# EAGLE design BusPiratev3.5-SOIC (EAGLE 5.07)
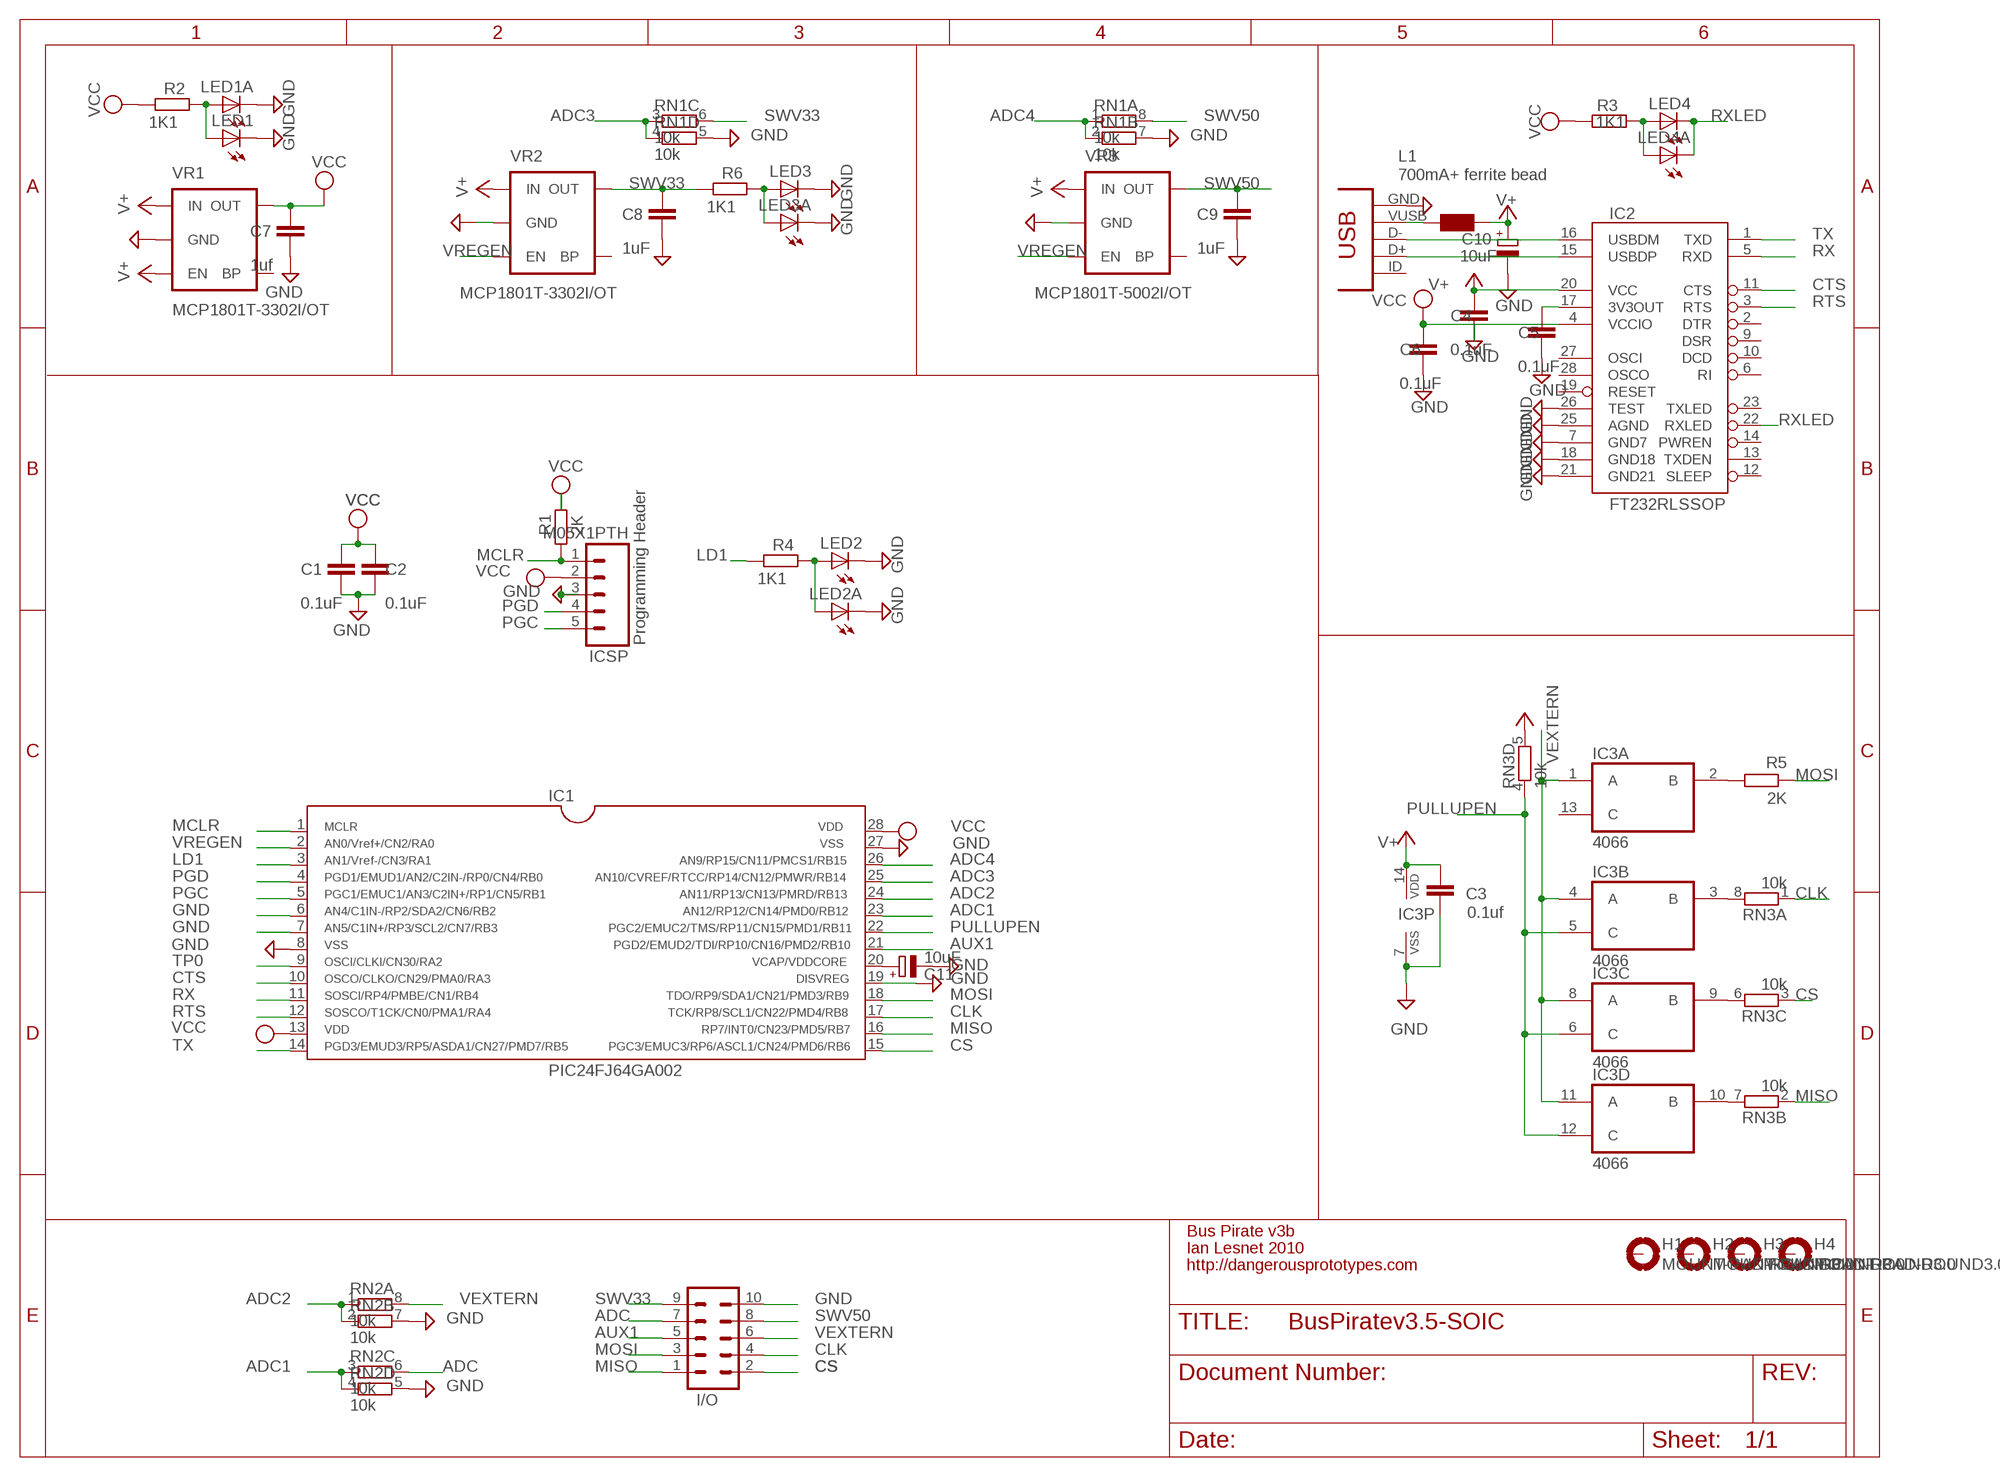
[diagram p0: schematic, sheet 1]

## Parts
C1  0.1uF  CAPC603  [C603]
C2  0.1uF  CAPC603  [C603]
C3  0.1uf  CAPC603  [C603]
C4  0.1uF  CAPC603  [C603]
C5  0.1uF  CAPC603  [C603]
C6  0.1uF  CAPC603  [C603]
C7  1uf  CAPC603  [C603]
C8  1uF  CAPC603  [C603]
C9  1uF  CAPC603  [C603]
C10  10uF  CPOL-EUSMCA  [SMC_A]
C11  10uF  CPOL-EUSMCA  [SMC_A]
H1  MOUNT-PAD-ROUND3.0  [3,0-PAD]
H2  MOUNT-PAD-ROUND3.0  [3,0-PAD]
H3  MOUNT-PAD-ROUND3.0  [3,0-PAD]
H4  MOUNT-PAD-ROUND3.0  [3,0-PAD]
I/O  SPARKFUN_M05X2SHD  [SPARKFUN_2X5-SHROUDED]
IC1  PIC24FJ64GA002  [SO28W]
IC2  FT232RLSSOP  [SSOP28DB]
IC3  4066  [TSSOP14]
ICSP  M05X1PTH  M05  [1X05]
J1  CONN_USB  [CONN_USB_MINI-B]
L1  700mA+ ferrite bead  WE-KIL_0805  [WE-KI_0805_B]
LED1  LEDCHIP-LED0805  [CHIP-LED0805]
LED1A  LEDCHIP-LED0805  [CHIP-LED0805]
LED2  LEDCHIP-LED0805  [CHIP-LED0805]
LED2A  LEDCHIP-LED0805  [CHIP-LED0805]
LED3  LEDCHIP-LED0805  [CHIP-LED0805]
LED3A  LEDCHIP-LED0805  [CHIP-LED0805]
LED4  LEDCHIP-LED0805  [CHIP-LED0805]
LED4A  LEDCHIP-LED0805  [CHIP-LED0805]
R1  2K  RESISTORR603  [R603]
R2  1K1  RESISTORR603  [R603]
R3  1K1  RESISTORR603  [R603]
R4  1K1  RESISTORR603  [R603]
R5  2K  RESISTORR603  [R603]
R6  1K1  RESISTORR603  [R603]
RN1  10k  RNETWORK  [RN8P-4R-CRA06S]
RN2  10k  RNETWORK  [RN8P-4R-CRA06S]
RN3  10k  RNETWORK  [RN8P-4R-CRA06S]
VR1  MCP1801T-3302I/OT  V_REG_LDOSMD  [SOT23-5]
VR2  MCP1801T-3302I/OT  V_REG_LDOSMD  [SOT23-5]
VR3  MCP1801T-5002I/OT  V_REG_LDOSMD  [SOT23-5]

## Nets
$N26: J1.VUSB L1.2
ADC: I/O.7 RN2.6
ADC1: IC1.23 RN2.3 RN2.4
ADC2: IC1.24 RN2.1 RN2.2
ADC3: IC1.25 RN1.3 RN1.4
ADC4: IC1.26 RN1.1 RN1.2
AUX1: I/O.5 IC1.21
CLK: I/O.4 IC1.17 RN3.1
CS: I/O.2 IC1.15 RN3.3
CTS: IC1.10 IC2.11(CTS)
GND: C1.2 C2.2 C3.2 C4.2 C5.2 C6.2 C7.2 C8.2 C9.2 C10.- C11.- I/O.10 IC1.6 IC1.7 IC1.8 IC1.19 IC1.27 IC2.7(GND7) IC2.18(GND18) IC2.21(GND21) IC2.25(AGND) IC2.26(TEST) IC3.7(P:VSS) ICSP.3 J1.GND LED1.C LED1A.C LED2.C LED2A.C LED3.C LED3A.C RN1.5 RN1.7 RN2.5 RN2.7 VR1.2(GND) VR2.2(GND) VR3.2(GND)
LD1: IC1.3 R4.2
MCLR: IC1.1 ICSP.1 R1.1
MISO: I/O.1 IC1.16 RN3.2
MOSI: I/O.3 IC1.18 R5.1
N$1: IC3.2(A:B) R5.2
N$2: IC3.9(C:B) RN3.6
N$3: C11.+ IC1.20
N$4: IC3.10(D:B) RN3.7
N$5: IC3.3(B:B) RN3.8
N$6: LED2.A LED2A.A R4.1
N$7: LED1.A LED1A.A R2.1
N$9: C5.1 IC2.17(3V3OUT)
N$13: LED4.A LED4A.A R3.1
N$15: IC2.15(USBDP) J1.D+
N$16: IC2.16(USBDM) J1.D-
N$18: LED3.A LED3A.A R6.1
PGC: IC1.5 ICSP.5
PGD: IC1.4 ICSP.4
PULLUPEN: IC1.22 IC3.5(B:C) IC3.6(C:C) IC3.12(D:C) RN3.4
RTS: IC1.12 IC2.3(RTS)
RX: IC1.11 IC2.5(RXD)
RXLED: IC2.22(RXLED) LED4.C LED4A.C
SWV33: C8.1 I/O.9 R6.2 RN1.6 VR2.5(OUT)
SWV50: C9.1 I/O.8 RN1.8 VR3.5(OUT)
TP0: IC1.9
TX: IC1.14 IC2.1(TXD)
V+: C3.1 C4.1 C10.+ IC2.20(VCC) IC3.14(P:VDD) L1.1 RN3.5 VR1.1(IN) VR1.3(EN) VR2.1(IN) VR3.1(IN)
VCC: C1.1 C2.1 C6.1 C7.1 IC1.13 IC1.28 IC2.4(VCCIO) ICSP.2 R1.2 R2.2 R3.2 VR1.5(OUT)
VEXTERN: I/O.6 IC3.1(A:A) IC3.4(B:A) IC3.8(C:A) IC3.11(D:A) RN2.8
VREGEN: IC1.2 VR2.3(EN) VR3.3(EN)
Unconnected: H1.B3,0(MOUNT) H2.B3,0(MOUNT) H3.B3,0(MOUNT) H4.B3,0(MOUNT) IC2.2(DTR) IC2.6(RI) IC2.9(DSR) IC2.10(DCD) IC2.12(SLEEP) IC2.13(TXDEN) IC2.14(PWREN) IC2.19(RESET) IC2.23(TXLED) IC2.27(OSCI) IC2.28(OSCO) IC3.13(A:C) J1.BODY@1(BODY) J1.BODY@2(BODY) J1.BODY@3(BODY) J1.BODY@4(BODY) J1.ID(USBID) VR1.4(BP) VR2.4(BP) VR3.4(BP)

## Notes on the sheet
- Programming Header
- Bus Pirate v3b
- Ian Lesnet 2010
- http://dangerousprototypes.com

## Library data of the parts
C1-C9 = dp_devices:CAP
C10 C11 = rcl:CPOL-EU: POLARIZED CAPACITOR, European symbol
H1-H4 = holes:MOUNT-PAD-ROUND: MOUNTING PAD, round
I/O = BusPirate-v3.1:SPARKFUN_M05X2: Header 5x2 Standard 10-pin dual row 0.1" header. Commonly used with AVR-ISP. Use with Spark Fun Electronics SKU: PRT-00778
IC1 = BusPirate-v3.1:PIC24FJ64GA002
IC2 = SparkFun:FT232RL: USB UART FT232RL 4th Generation USB UART (USB <-> Serial) Controller. Spark Fun Electronics SKU : COM-00650
IC3 = 40xx:4066: Quad bilateral ANALOG SWITCH
ICSP = SparkFun:M05: Header 5 Standard 5-pin 0.1" header. Use with straight break away headers (SKU : PRT-00116), right angle break away headers (PRT-00553), swiss pins (PRT-00743), machine pins (PRT-00117), and female headers (PRT-00115). Molex polarized connector foot print use with SKU : PRT-08230 with associated crimp pins and housings.
J1 = dp_devices:CONN_USB: USB connector
L1 = wuerth-elektronik:WE-KIL: SMD Wire Wound Ceramic Inductor WE-KIL - Low profile - High Q values -- Bluetooth -- Wireless LAN -- RF oscillation circuit -- IF impedance matching
LED1 LED1A LED2 LED2A LED3 LED3A LED4 LED4A = led:LED: LED OSRAM: - CHIPLED LG R971, LG N971, LY N971, LG Q971, LY Q971, LO R971, LY R971 LH N974, LH R974 LS Q976, LO Q976, LY Q976 LO Q996 - Hyper CHIPLED LW Q18S LB Q993, LB Q99A, LB R99A - SideLED LS A670, LO A670, LY A670, LG A670, LP A670 LB A673, LV A673, LT A673, LW A673 LH A674 LY A675 LS A676, LA A676, LO A676, LY A676, LW A676 LS A679, LY A679, LG A679 - Hyper Micro SIDELED® LS Y876, LA Y876, LO Y876, LY Y876 LT Y87S - SmartLED LW L88C, LW L88S LB L89C, LB L89S, LG L890 LS L89K, LO L89K, LY L89K LS L896, LA L896, LO L896, LY L896 - TOPLED LS T670, LO T670, LY T670, LG T670, LP T670 LSG T670, LSP T670, LSY T670, LOP T670, LYG T670 LG T671, LOG T671, LSG T671 LB T673, LV T673, LT T673, LW T673 LH T674 LS T676, LA T676, LO T676, LY T676, LB T676, LH T676, LSB T676, LW T676 LB T67C, LV T67C, LT T67C, LS T67K, LO T67K, LY T67K, LW E67C LS E67B, LA E67B, LO E67B, LY E67B, LB E67C, LV E67C, LT E67C LW T67C LS T679, LY T679, LG T679 LS T770, LO T770, LY T770, LG T770, LP T770 LB T773, LV T773, LT T773, LW T773 LH T774 LS E675, LA E675, LY E675, LS T675 LS T776, LA T776, LO T776, LY T776, LB T776 LHGB T686 LT T68C, LB T68C - Hyper Mini TOPLED® LB M676 - Mini TOPLED Santana® LG M470 LS M47K, LO M47K, LY M47K Source: http://www.osram.convergy.de LUXEON: - LUMILED® LXK2-PW12-R00, LXK2-PW12-S00, LXK2-PW14-U00, LXK2-PW14-V00 LXK2-PM12-R00, LXK2-PM12-S00, LXK2-PM14-U00 LXK2-PE12-Q00, LXK2-PE12-R00, LXK2-PE12-S00, LXK2-PE14-T00, LXK2-PE14-U00 LXK2-PB12-K00, LXK2-PB12-L00, LXK2-PB12-M00, LXK2-PB14-N00, LXK2-PB14-P00, LXK2-PB14-Q00 LXK2-PR12-L00, LXK2-PR12-M00, LXK2-PR14-Q00, LXK2-PR14-R00 LXK2-PD12-Q00, LXK2-PD12-R00, LXK2-PD12-S00 LXK2-PH12-R00, LXK2-PH12-S00 LXK2-PL12-P00, LXK2-PL12-Q00, LXK2-PL12-R00 Source: www.luxeon.com KINGBRIGHT: KA-3528ASYC Source: www.kingbright.com
R1-R6 = dp_devices:RESISTOR
RN1-RN3 = dp_devices:RNETWORK: 4 Resistor Array 0603
VR1-VR3 = SparkFun:V_REG_LDO: Voltage Regulator LDO Standard 150mA LDO voltage regulator in SOT-23 layout. Micrel part MIC5205. BP (by-pass) pin is used to lower output noise with 470pF cap.

## Board
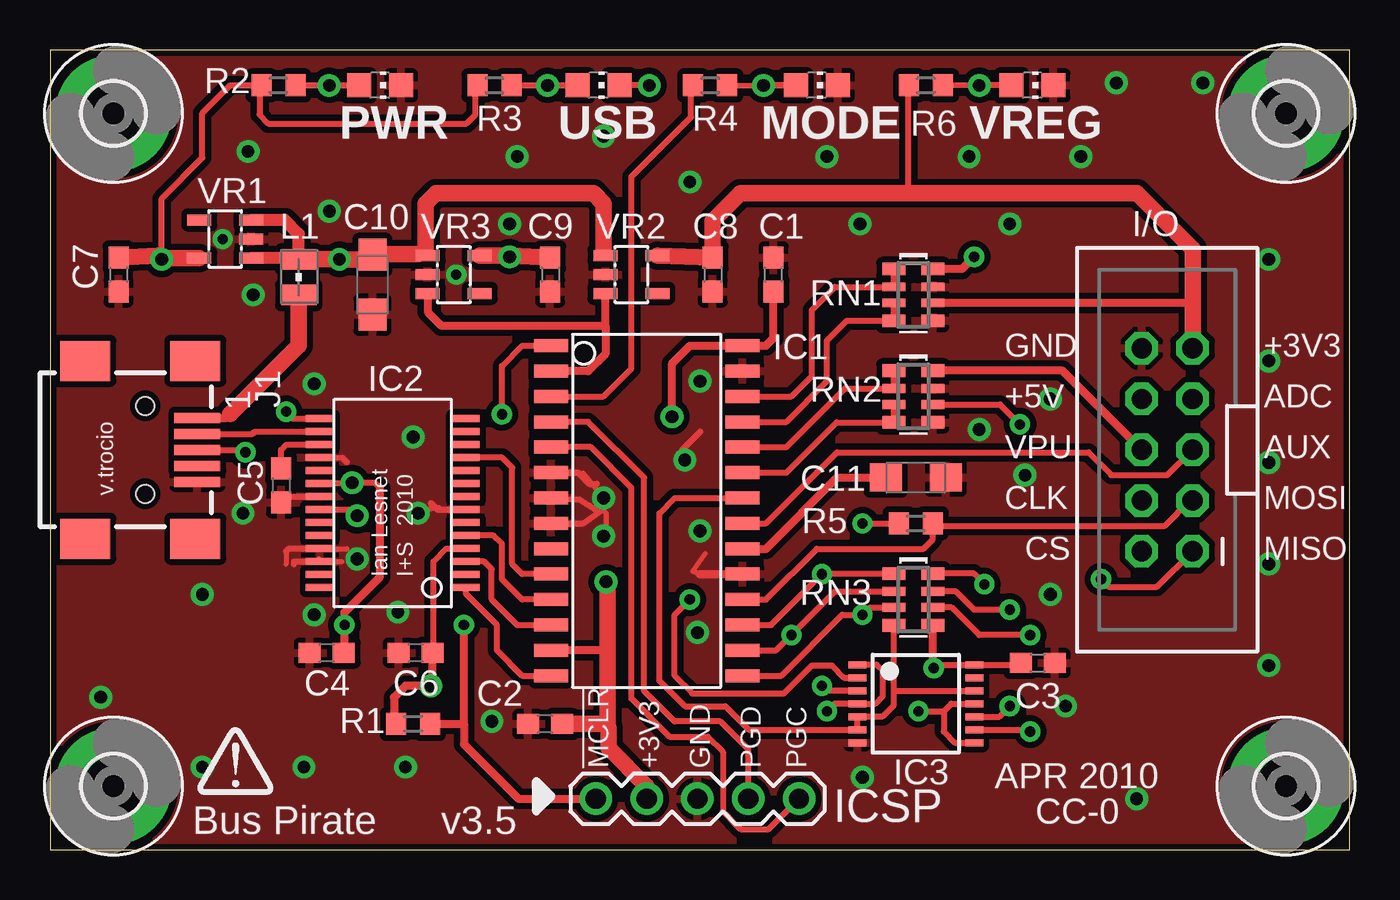
[diagram p1: board, top side]
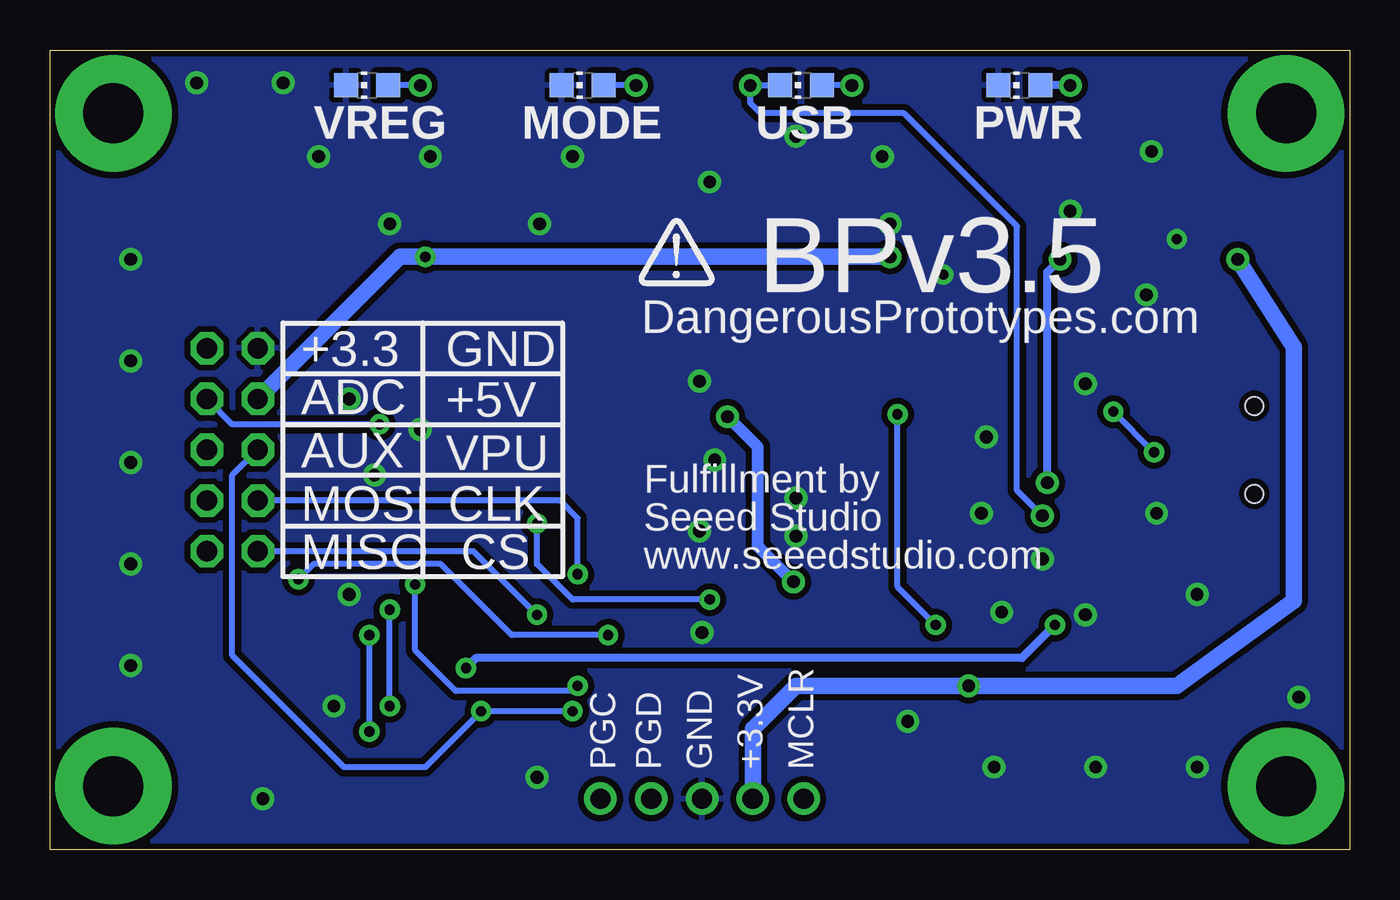
[diagram p2: board, bottom side, seen from below]

Size 65 x 40 mm. Coordinates in mm from the lower left corner, seen from the top.
Outline: 0,40 0,0 65,0 65,40 0,40
Copper layers (1*16): Top 0.035mm / dielectric 1.5mm / Bottom 0.035mm
Design rules "SparkFun": minimum track width 8mil, minimum drill 20mil, track to track 8mil, track to pad 8mil, pad to pad 8mil, via to via 8mil, smd to smd 8mil, copper to edge 10mil, drill to drill 8mil, minimum pad ring 12mil, minimum via ring 10mil, stop-mask expansion 4mil, vias tented up to drill 25mil, thermal gap 10mil

### Footprints (pad centres in the part's own frame; a part is rotated, then mirrored left to right if it is on the bottom)
C603 = smd 1.1 x 1: 1 -0.85,0; 2 0.85,0
SMC_A = smd 1.6 x 1.4: + -1.5,0; - 1.5,0
3,0-PAD = drill 3 pad 5.842 round: B3,0 0,0
SPARKFUN_2X5-SHROUDED = drill 1.016 octagon: 1 -1.27,5.08; 2 1.27,5.08; 3 -1.27,2.54; 4 1.27,2.54; 5 -1.27,0; 6 1.27,0; 7 -1.27,-2.54; 8 1.27,-2.54; 9 -1.27,-5.08; 10 1.27,-5.08
SO28W = smd 0.65 x 1.7: 1 -7.62,-4.78; 2 -6.35,-4.78; 3 -5.08,-4.78; 4 -3.81,-4.78; 5 -2.54,-4.78; 6 -1.27,-4.78; 7 0,-4.78; 8 1.27,-4.78; 9 2.54,-4.78; 10 3.81,-4.78; 11 5.08,-4.78; 12 6.35,-4.78; 13 7.62,-4.78; 14 8.89,-4.78; 15 8.89,4.78; 16 7.62,4.78; 17 6.35,4.78; 18 5.08,4.78; 19 3.81,4.78; 20 2.54,4.78; 21 1.27,4.78; 22 0,4.78; 23 -1.27,4.78; 24 -2.54,4.78; 25 -3.81,4.78; 26 -5.08,4.78; 27 -6.35,4.78; 28 -7.62,4.78
SSOP28DB = smd 0.348 x 1.397: 1 -4.225,-3.656; 2 -3.575,-3.656; 3 -2.925,-3.656; 4 -2.275,-3.656; 5 -1.625,-3.656; 6 -0.975,-3.656; 7 -0.325,-3.656; 8 0.325,-3.656; 9 0.975,-3.656; 10 1.625,-3.656; 11 2.275,-3.656; 12 2.925,-3.656; 13 3.575,-3.656; 14 4.225,-3.656; 15 4.225,3.656; 16 3.575,3.656; 17 2.925,3.656; 18 2.275,3.656; 19 1.625,3.656; 20 0.975,3.656; 21 0.325,3.656; 22 -0.325,3.656; 23 -0.975,3.656; 24 -1.625,3.656; 25 -2.275,3.656; 26 -2.925,3.656; 27 -3.575,3.656; 28 -4.225,3.656
TSSOP14 = smd 0.35 x 0.9: 1 -1.95,-2.925; 2 -1.3,-2.925; 3 -0.65,-2.925; 4 0,-2.925; 5 0.65,-2.925; 6 1.3,-2.925; 7 1.95,-2.925; 8 1.95,2.925; 9 1.3,2.925; 10 0.65,2.925; 11 0,2.925; 12 -0.65,2.925; 13 -1.3,2.925; 14 -1.95,2.925
1X05 = drill 1.016 round: 1 0,0; 2 2.54,0; 3 5.08,0; 4 7.62,0; 5 10.16,0
CONN_USB_MINI-B = smd 2 x 2.5: BODY@1 -4.45,2.5; BODY@2 4.45,2.5; BODY@3 4.45,-3; BODY@4 -4.45,-3 | smd 0.5 x 2.3: D+ 0,2.6; D- -0.8,2.6; GND 1.6,2.6; ID 0.8,2.6; VUSB -1.6,2.6 | hole 0.9: -2.2,0; 2.2,0
WE-KI_0805_B = smd 1.02 x 1.78: 1 -0.89,0; 2 0.89,0
CHIP-LED0805 = smd 1.2 x 1.2: A 0,-1.05; C 0,1.05
R603 = smd 1 x 1.1: 1 -0.85,0; 2 0.85,0
RN8P-4R-CRA06S = smd 0.63 x 1.15: 1 -1.295,-0.975; 4 1.295,-0.975; 5 1.295,0.975; 8 -1.295,0.975 | smd 0.44 x 1.15: 2 -0.4,-0.975; 3 0.4,-0.975; 6 0.4,0.975; 7 -0.4,0.975
SOT23-5 = smd 0.55 x 1.2: 1 -0.95,-1.3; 2 0,-1.3; 3 0.95,-1.3; 4 0.95,1.3; 5 -0.95,1.3

### Placement (x,y rotation side)
C1  36.2,28.76 90 top
C2  24.77,6.28 180 top
C3  49.4,9.33 0 top
C4  13.84,9.84 180 top
C5  11.56,18.22 270 top
C6  18.29,9.84 180 top
C7  3.43,28.76 270 top
C8  33.15,28.76 270 top
C9  25.02,28.76 270 top
C10  16.13,28.25 270 top
C11  43.31,18.6 0 top
H1  3.17,3.17 0 top
H2  3.17,36.83 0 top
H3  61.83,36.83 0 top
H4  61.83,3.17 0 top
I/O  55.88,20 180 top
IC1  29.84,17.59 270 top
IC2  17.14,17.33 90 top
IC3  43.31,7.3 270 top
ICSP  27.3,2.54 0 top
J1  4.76,20 270 top
L1  12.45,28.64 270 top
LED1  16.51,38.23 270 top
LED1A  16.51,38.23 90 bottom
LED2  38.35,38.23 270 top
LED2A  38.35,38.23 90 bottom
LED3  49.15,38.23 270 top
LED3A  49.15,38.23 90 bottom
LED4  27.43,38.23 270 top
LED4A  27.43,38.23 90 bottom
R1  18.16,6.28 180 top
R2  11.43,38.23 180 top
R3  22.23,38.23 180 top
R4  33.02,38.23 180 top
R5  43.31,16.32 180 top
R6  43.81,38.23 180 top
RN1  43.18,27.75 270 top
RN2  43.18,22.67 270 top
RN3  43.18,12.51 270 top
U$1  [DP-LOGO]  7.37,2.73 0 top
U$2  [DP-LOGO-BOTTOM]  31.75,28.19 0 top
VR1  8.76,30.54 90 top
VR2  29.08,28.76 270 top
VR3  20.19,28.76 270 top

### Tracks (layer width: path | path; a pad name or v marks a point on that pad's centre or on a via)
$N26
  Top 0.406: J1.VUSB 8.84,21.6 9.02,21.78
  Top 0.813: L1.2 12.45,25.21 9.02,21.78
ADC  (via drill 0.51)
  Top 0.305: RN2.6 47.52,22.27 v48.51,21.27
  Bottom 0.305: v48.51,21.27 55.88,21.27 I/O.7
ADC1
  Top 0.305: IC1.23 36.83,18.86 39.34,21.37 RN2.4 RN2.3
ADC2
  Top 0.305: IC1.24 36.83,20.13 39.77,23.07 RN2.2 RN2.1
ADC3
  Top 0.305: RN1.3 RN1.4 39.85,26.45 38.86,25.46 38.86,23.43 36.83,21.4 IC1.25
ADC4
  Top 0.305: IC1.26 37.08,22.67 38.1,23.68 38.1,26.98 39.26,28.15 RN1.2 RN1.1
AUX1
  Top 0.305: IC1.21 35.81,16.32 39.37,19.87 51.94,19.87 53.09,18.73 55.88,18.73 I/O.5
CLK  (via drill 0.51)
  Top 0.305: IC1.17 36.07,11.24 v38.61,13.78 39.14,13.8 RN3.1
  Bottom 0.305: I/O.4 39.5,17.46 38.61,16.57 v38.61,13.78
CS  (via drill 0.51)
  Top 0.305: RN3.3 41,12.11 v40.64,11.74 39.62,11.74 36.58,8.7 IC1.15
  Bottom 0.305: I/O.2 43.81,14.92 v40.64,11.74
CTS
  Top 0.305: IC2.11 22.62,19.61 23.11,19.11 23.11,14.29 23.62,13.78 IC1.10
GND  (via drill 0.51, 0.64)
  Top 0.254: IC2.18 14.62,19.61 | 27.63,17.01 27.81,16.82 27.81,15.81 v27.69,15.68 | 32.51,13.78 32.16,13.93 32.77,14.79 | 11.81,14.92 11.81,14.29 | IC1.6 26.67,18.82 v27.69,17.59 | 13.34,15.05 14.86,15.05 | 13.46,14.41 13.46,14.54 | 13.46,14.41 14.61,14.41 | IC2.26 13.47,14.41 13.46,14.41
  Top 0.305: 19.38,17.01 19.45,17.08 19.3,17.08 | 19.3,17.08 19.05,17.08 | 19.38,17.01 IC2.7 | 19.3,17.08 19.05,17.33 | 19.3,17.08 19.38,17.01 | 14.62,19.61 14.86,19.36 | IC1.8 26.67,16.32 27.63,17.01 | IC2.21 11.68,17.66 C5.2 | IC2.25 11.95,15.06 11.81,14.92 | IC2.26 12.19,14.41 12.19,14.29 | 32.53,20.91 31.62,20 31.62,19.62 v31.75,19.49 | 25.35,18.81 25.4,18.86 26.42,18.86 26.98,18.3 27.36,18.3 | 27.28,17 26.49,17.51 24.94,17.54
  Top 0.406: 32.51,13.78 IC1.19
  other vias: 32.51,15.94 22.99,31.3 20.32,28.76 8.64,30.54 7.62,4.12 12.7,4.12 17.78,4.12 22.1,6.41 2.54,7.62 54.36,2.54 60.96,9.21 60.96,14.29 60.96,19.36 60.96,24.45 60.96,29.52 53.34,38.35 48.01,31.3 32.51,23.43 40.51,31.3 38.86,34.67 45.97,34.67 27.69,35.69 13.97,31.94 18.16,20.64 18.41,16.82 17.4,11.87 13.21,11.74 7.62,12.76 9.65,16.82 10.16,27.75 13.21,23.3 32.38,10.86 15.37,14.54 50.04,12.76 50.8,7.17 40.64,3.62 48.77,18.73 50.04,22.54 46.48,21.02 23.37,34.67 32,33.4 51.56,34.67 57.66,38.35 9.91,34.92
  pour Top (isolate 0.305): 0,40 65,40 65,0 0,0
  pour Bottom (isolate 0.305): 0,40 65,40 65,0 0,0
LD1
  Top 0.305: R4.2 32.26,38.1 32.07,37.91 32.07,36.64 29.08,33.66 29.08,24.06 27.69,22.67 IC1.3
  Top 0.406: R4.2 31.88,37.91
MCLR  (via drill 0.51)
  Top 0.305: v22.61,21.78 22.61,24.19 23.62,25.21 IC1.1
  Top 0.406: 20.7,6.28 20.7,5.27 23.43,2.54 ICSP.1 | 20.7,6.28 v20.7,11.24 | R1.1 20.7,6.28
  Bottom 0.305: v22.61,21.78 22.61,13.14 v20.7,11.24
MISO  (via drill 0.51)
  Top 0.305: RN3.2 39.26,12.91 v37.08,10.73 36.32,9.97 IC1.16 | I/O.1 55.37,13.14 52.96,13.14 v52.58,13.52
  Bottom 0.305: v52.58,13.52 51.82,14.29 45.47,14.29 41.91,10.73 v37.08,10.73
MOSI
  Top 0.305: IC1.18 35.81,12.51 38.35,15.05 43.69,15.05 44.16,15.52 R5.1 44.28,16.19 55.75,16.19 57.02,17.46 I/O.3
N$1  (via drill 0.51)
  Top 0.305: v40.64,16.32 R5.2 | IC3.2 39.72,8.6 39.12,9.21 38.1,9.21 36.7,7.81 32.13,7.81 31.24,8.7 31.24,11.74 v32,12.51
  Bottom 0.305: v40.64,16.32 40.64,14.29 38.86,12.51 v32,12.51
N$2  (via drill 0.51)
  Top 0.305: IC3.9 48.92,6 v49.02,5.9 | RN3.6 45.1,12.11 46.48,10.73 v49.02,10.73
  Bottom 0.305: v49.02,5.9 v49.02,10.73
N$3
  Top 0.406: IC1.20 35.81,15.05 39.37,18.6 C11.+
N$4  (via drill 0.51)
  Top 0.305: IC3.10 47.48,6.65 v48.01,7.17 | RN3.7 45.32,12.91 46.23,12 v48.01,12
  Bottom 0.305: v48.01,7.17 v48.01,12
N$5  (via drill 0.51)
  Top 0.305: RN3.8 46.2,13.8 v46.74,13.27 | IC3.3 38.85,7.95 v38.61,8.19
  Bottom 0.305: v46.74,13.27 46.74,9.97 44.7,7.93 38.86,7.93 v38.61,8.19
N$6  (via drill 0.64)
  Top 0.305: 34.13,38.2 LED2A.A v35.69,38.23
  Top 0.406: R4.1 34.13,38.2
  Bottom 0.305: v35.69,38.23 LED2A.A
N$7  (via drill 0.64)
  Top 0.305: LED1A.A v13.97,38.23 R2.1
  Top 0.406: R2.1 12.19,38.23
  Bottom 0.406: v13.97,38.23 LED1A.A
N$9
  Top 0.305: IC2.17 11.81,20.26 11.56,20 C5.1
N$13  (via drill 0.64)
  Top 0.305: R3.1 v24.89,38.23 LED4A.A
  Bottom 0.305: v24.89,38.23 LED4A.A
N$15  (via drill 0.51)
  Top 0.305: IC2.15 12.16,21.56 v11.81,21.91 | J1.D+ 9.65,20 v9.78,19.87
  Bottom 0.305: v9.78,19.87 v11.81,21.91
N$16
  Top 0.254: IC2.16 13.51,20.89
  Top 0.305: IC2.16 10.24,20.91 10.13,20.8 J1.D-
N$18  (via drill 0.64)
  Top 0.305: R6.1 48.07,38.25 | LED3A.A v46.48,38.23
  Top 0.406: 48.07,38.25 LED3A.A
  Bottom 0.305: v46.48,38.23 LED3A.A
PGC
  Top 0.305: ICSP.5 35.94,1.02 34.54,1.02 33.66,1.91 33.66,4.89 32.89,5.65 30.99,5.65 29.08,7.55 29.08,18.09 27.05,20.13 IC1.5
PGD
  Top 0.305: IC1.4 26.92,21.4 29.72,18.6 29.72,7.93 31.24,6.41 33.53,6.41 34.92,5.01 ICSP.4
PULLUPEN
  Top 0.305: 42.2,7.93 42.2,7.21 41.66,6.67 40.4,6.67 IC3.5 IC3.6 34.95,6 33.78,7.17 31.75,7.17 30.48,8.44 30.48,16.82 31.24,17.59 IC1.22 | 42.2,7.93 RN3.4 | IC3.12 42.22,7.95 42.2,7.93
RTS
  Top 0.305: IC2.3 21.72,14.41 22.1,14.03 22.1,12.51 23.37,11.24 IC1.12
RX
  Top 0.305: IC2.5 22.2,15.71 22.61,15.3 22.61,13.52 23.62,12.51 IC1.11
RXLED  (via drill 0.64)
  Top 0.305: v29.97,38.23 LED4A.C | IC2.22 15.04,17.01 v15.37,16.7
  Top 0.406: LED4A.C 28.07,38.23
  Bottom 0.305: LED4A.C v29.97,38.23 29.97,37.34 29.46,36.83 22.29,36.83 16.64,31.18 16.64,17.97 v15.37,16.7
SWV33
  Top 0.305: R6.2 42.93,38.1 42.93,32.89 44.13,32.89 44.2,32.83
  Top 0.406: R6.2 42.99,38.23 | RN1.6 57,27.35 57.15,27.49
  Top 0.813: VR2.5 C8.1 33.15,31.43 34.54,32.83 44.2,32.83 54.36,32.83 57.15,30.03 57.15,27.49 I/O.9
SWV50  (via drill 0.51, 0.64)
  Top 0.406: RN1.8 45.62,29.04 v46.23,29.65
  Top 0.813: VR3.5 22.93,29.71 v22.99,29.65 23.05,29.71 C9.1
  Bottom 0.813: I/O.8 47.5,29.65 v46.23,29.65 v22.99,29.65
TX
  Top 0.305: IC2.1 20.8,12.79 22.35,11.24 22.35,9.97 23.62,8.7 IC1.14
V+  (via drill 0.51, 0.64)
  Top 0.305: IC2.20 15.07,18.31 v15.11,18.35 16.26,18.35 16.51,18.09 | C3.1 48.47,9.25 IC3.14 44.28,9.25 v44.2,9.08
  Top 0.406: v14.73,11.24 14.73,10.54 C4.1 14.73,9.88 v14.73,11.24 | v14.73,11.24 14.73,11.87 16.51,13.65 16.51,18.09 | RN3.5 44.16,9.88 v44.2,9.08
  Top 0.508: 18.8,30.03 18.8,29.78 18.86,29.71 VR3.1 18.57,30.03 18.41,29.78 | VR2.1 27.78,29.94 27.69,30.03
  Top 0.61: VR1.3 11.75,31.49 12.45,30.8 L1.1 12.38,29.59 VR1.1
  Top 0.813: L1.1 v14.48,29.53 v14.48,29.52 15.75,29.52 16,29.78 16.15,29.78 | 16.15,29.78 C10.+ | 18.8,30.03 18.8,32.32 19.3,32.83 27.18,32.83 27.69,32.32 27.69,30.03 | 16.15,29.78 18.41,29.78
  Bottom 0.406: v15.11,18.35 15.11,28.89 v14.48,29.52 | v14.73,11.24 16.38,9.59 43.69,9.59 v44.2,9.08
VCC  (via drill 0.64)
  Top 0.254: C6.1 19.18,9.9
  Top 0.305: v27.81,13.4 27.96,13.76 | R3.2 21.34,38.35 21.27,38.29 21.27,36.77 20.83,36.32 10.92,36.32 10.48,36.76 10.48,38.03 10.41,38.1 R2.2 9.02,38.23 7.62,36.83 7.62,34.6 5.59,32.57 v5.59,29.52 | v31.11,21.65 31.21,21.56 | 19.18,9.9 19.18,14.41 19.82,15.06 IC2.4
  Top 0.406: C6.1 19.14,8.36 19.3,8.19 19.24,8.25 v19.05,8.19 17.78,8.19 17.21,7.62 17.21,6.22 17.27,6.16 R1.2 | 27.88,9.97 IC1.13 | v31.11,21.65 31.11,24.32 32,25.21 IC1.28 35.81,25.21 36.2,25.59 C1.1
  Top 0.508: v5.59,29.52 5.65,29.59
  Top 0.61: 27.88,13.33 v27.81,13.4
  Top 0.813: 5.52,29.59 v5.59,29.52 5.4,29.71 C7.1 | 29.91,2.61 ICSP.2 29.84,3.17 27.94,5.08 27.94,6.09 27.88,6.09 27.88,6.28 | 27.88,13.33 27.88,9.97 27.88,6.28 | 27.88,6.28 C2.1 | 5.65,29.59 VR1.5
  Bottom 0.61: v27.81,13.4 29.59,15.17 29.59,20.13 v31.11,21.65
  Bottom 0.813: v5.59,29.52 2.79,25.15 2.79,12.45 8.64,8.19 v19.05,8.19 27.69,8.19 29.84,6.03 ICSP.2
VEXTERN  (via drill 0.51)
  Top 0.305: IC3.8 45.26,5.35 44.7,5.9 44.7,6.92 | IC3.11 45.09,7.3 44.7,6.92 | IC3.1 41.36,9.25 41.66,8.95 41.66,7.68 41.27,7.3 IC3.4 39.24,7.3 v38.86,6.92 | v43.43,6.92 44.7,6.92
  Top 0.406: RN2.8 50.65,23.96 I/O.6
  Bottom 0.305: v38.86,6.92 v43.43,6.92 46.23,4.12 50.29,4.12 55.88,9.71 55.88,18.73 I/O.6
VREGEN
  Top 0.406: VR3.3 18.89,26.89 19.56,26.22 27.78,26.22 | 27.78,26.22 27.78,24.8 26.92,23.94 IC1.2 | 27.78,26.22 VR2.3

### Text on the board
tPlace: GND | +3V3 | +5V | ADC | VPU | AUX | CLK | MOSI | CS | MISO | !MCLR | +3V3 | GND | PGD | PGC
tNames: PWR | USB | MODE | VREG | v.trocio | 2010 | Ian Lesnet | I+S | APR 2010 | Bus Pirate | v3.5 | CC-0
bNames: PWR | USB | MODE | VREG | BPv3.5 | DangerousPrototypes.com | GND | +3.3 | +5V | ADC | VPU | AUX | Fulfillment by | Seeed Studio | CLK | MOSI | www.seeedstudio.com | CS | MISO | MCLR | +3.3V | GND | PGD | PGC
Reference: GND | +3v | +5v | ADC | Vpu | AUX1 | USB | CLK | MOSI | CS | MISO | I/O header | MCLR | +3.3V | GND | DATA | CLOCK | Bus Pirate v3.5 | Ian Lesnet | Programming Header | CC-0 | April 2010 | http://dangerousprototypes.com